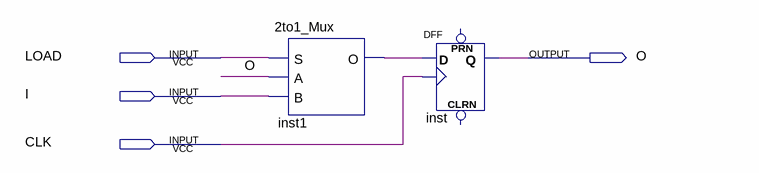
[diagram p0: schematic sheet]
// Quartus schematic 1bit_Register.bdf as structural Verilog: 2 symbols, 4 pins
module \1bit_Register  (
  input  LOAD,
  input  I,
  input  CLK,
  output O
);

  wire inst1_o;

  \2to1_Mux  inst1 (.A(O), .B(I), .S(LOAD), .O(inst1_o));
  DFF inst (.CLK(CLK), .D(inst1_o), .Q(O));  // open: CLRN, PRN
endmodule
